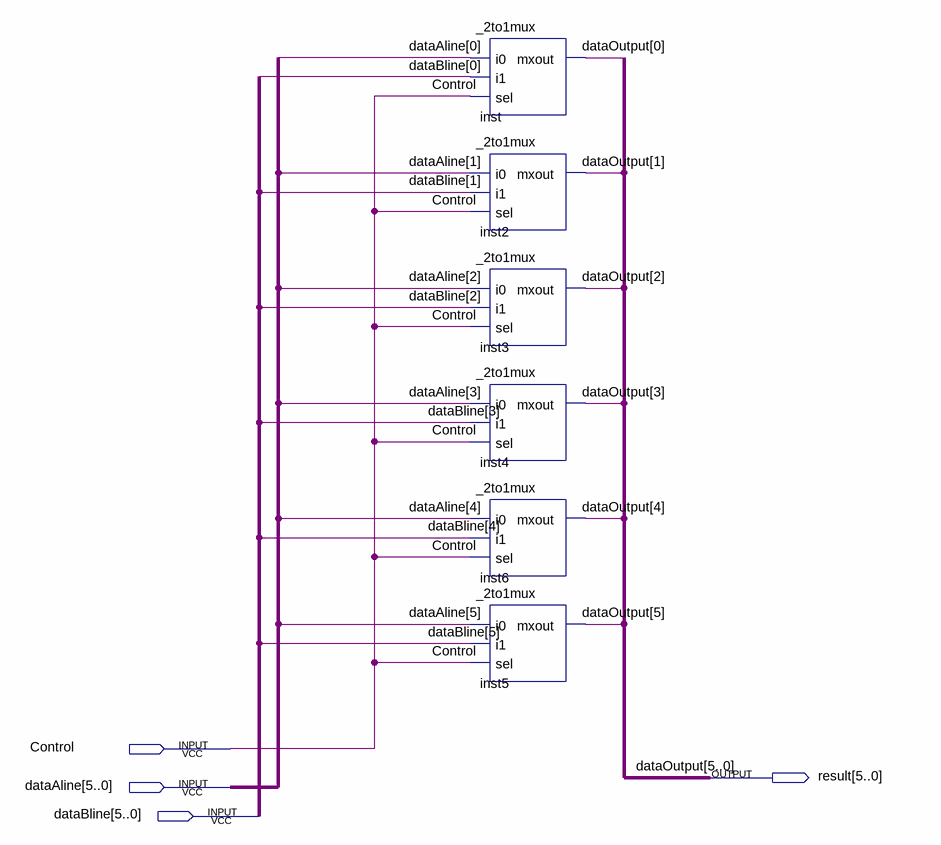
[diagram p0: schematic sheet]
// Quartus schematic 6WideBusMux.bdf as structural Verilog: 6 symbols, 4 pins
module \6WideBusMux  (
  input  Control,
  input  [5:0] dataAline,
  input  [5:0] dataBline,
  output [5:0] result
);

  _2to1mux inst (.i0(dataAline[0]), .i1(dataBline[0]), .sel(Control), .mxout(result[0]));
  _2to1mux inst2 (.i0(dataAline[1]), .i1(dataBline[1]), .sel(Control), .mxout(result[1]));
  _2to1mux inst3 (.i0(dataAline[2]), .i1(dataBline[2]), .sel(Control), .mxout(result[2]));
  _2to1mux inst4 (.i0(dataAline[3]), .i1(dataBline[3]), .sel(Control), .mxout(result[3]));
  _2to1mux inst6 (.i0(dataAline[4]), .i1(dataBline[4]), .sel(Control), .mxout(result[4]));
  _2to1mux inst5 (.i0(dataAline[5]), .i1(dataBline[5]), .sel(Control), .mxout(result[5]));

  // Other names for the same wires on the sheet: dataOutput[5:0] = result
endmodule
